# Altium schematic sheet testBoard-drw8833.SchDoc
size A
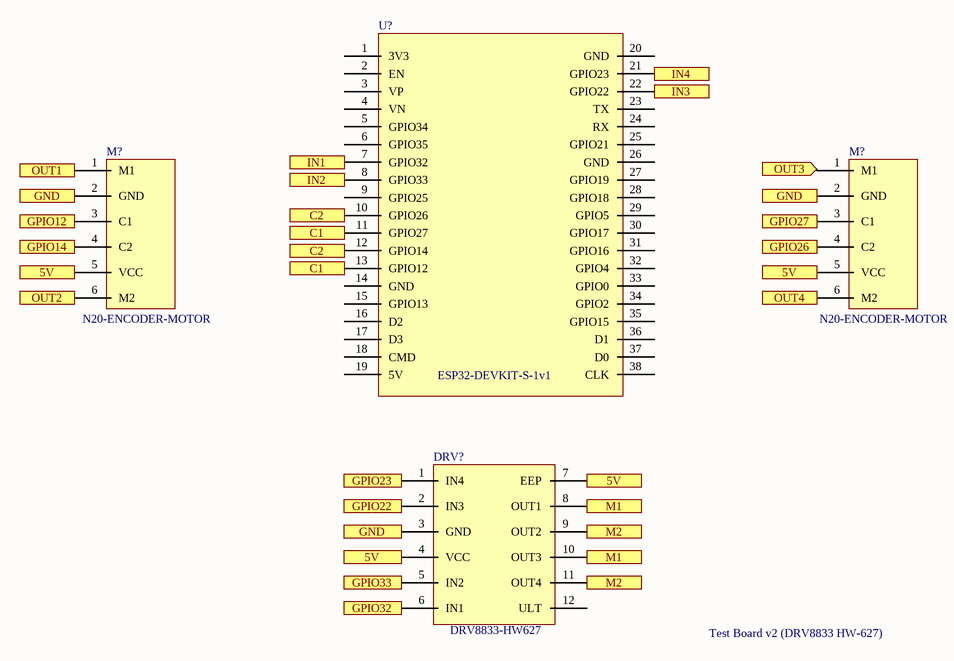
[diagram p0: testBoard-drw8833.SchDoc]

## Parts
(Parts that share a designator on the sheet are numbered #1, #2 ... from top to bottom, then left to right.)
DRV?  DRV8833-HW627
M?#1  N20-ENCODER-MOTOR
M?#2  N20-ENCODER-MOTOR
U?  ESP32-DEVKIT-S-1v1

## Ports
5V (in), C1 (in), C2 (in), GND (in), GPIO12 (in), GPIO14 (in), GPIO22 (in), GPIO23 (in), GPIO26 (in), GPIO27 (in), GPIO32 (in), GPIO33 (in), IN1 (in), IN2 (in), IN3 (in), IN4 (in), M1 (in), M2 (in), OUT1 (in), OUT2 (in), OUT3 (in), OUT4 (in)

## Nets
5V: DRV?.4(VCC) DRV?.7(EEP) M?#1.5(VCC) M?#2.5(VCC) ; port 5V
C1: U?.11(GPIO27) U?.13(GPIO12) ; port C1
C2: U?.10(GPIO26) U?.12(GPIO14) ; port C2
GND: DRV?.3(GND) M?#1.2(GND) M?#2.2(GND) ; port GND
GPIO12: M?#1.3(C1) ; port GPIO12
GPIO14: M?#1.4(C2) ; port GPIO14
GPIO22: DRV?.2(IN3) ; port GPIO22
GPIO23: DRV?.1(IN4) ; port GPIO23
GPIO26: M?#2.4(C2) ; port GPIO26
GPIO27: M?#2.3(C1) ; port GPIO27
GPIO32: DRV?.6(IN1) ; port GPIO32
GPIO33: DRV?.5(IN2) ; port GPIO33
IN1: U?.7(GPIO32) ; port IN1
IN2: U?.8(GPIO33) ; port IN2
IN3: U?.22(GPIO22) ; port IN3
IN4: U?.21(GPIO23) ; port IN4
M1: DRV?.8(OUT1) DRV?.10(OUT3) ; port M1
M2: DRV?.9(OUT2) DRV?.11(OUT4) ; port M2
OUT1: M?#1.1(M1) ; port OUT1
OUT2: M?#1.6(M2) ; port OUT2
OUT3: M?#2.1(M1) ; port OUT3
OUT4: M?#2.6(M2) ; port OUT4

Not connected (* = marked no-connect by the designer): DRV? 12(ULT); U? 1(3V3) 2(EN) 3(VP) 4(VN) 5(GPIO34) 6(GPIO35) 9(GPIO25) 14(GND) 15(GPIO13) 16(D2) 17(D3) 18(CMD) 19(5V) 20(GND) 23(TX) 24(RX) 25(GPIO21) 26(GND) 27(GPIO19) 28(GPIO18) 29(GPIO5) 30(GPIO17) 31(GPIO16) 32(GPIO4) 33(GPIO0) 34(GPIO2) 35(GPIO15) 36(D1) 37(D0) 38(CLK)

## Notes on the sheet
- Test Board v2 (DRV8833 HW-627)